# EAGLE schematic PocketCHIP-v1.0 (EAGLE 7.6.0)

## Sheet 1 of 2
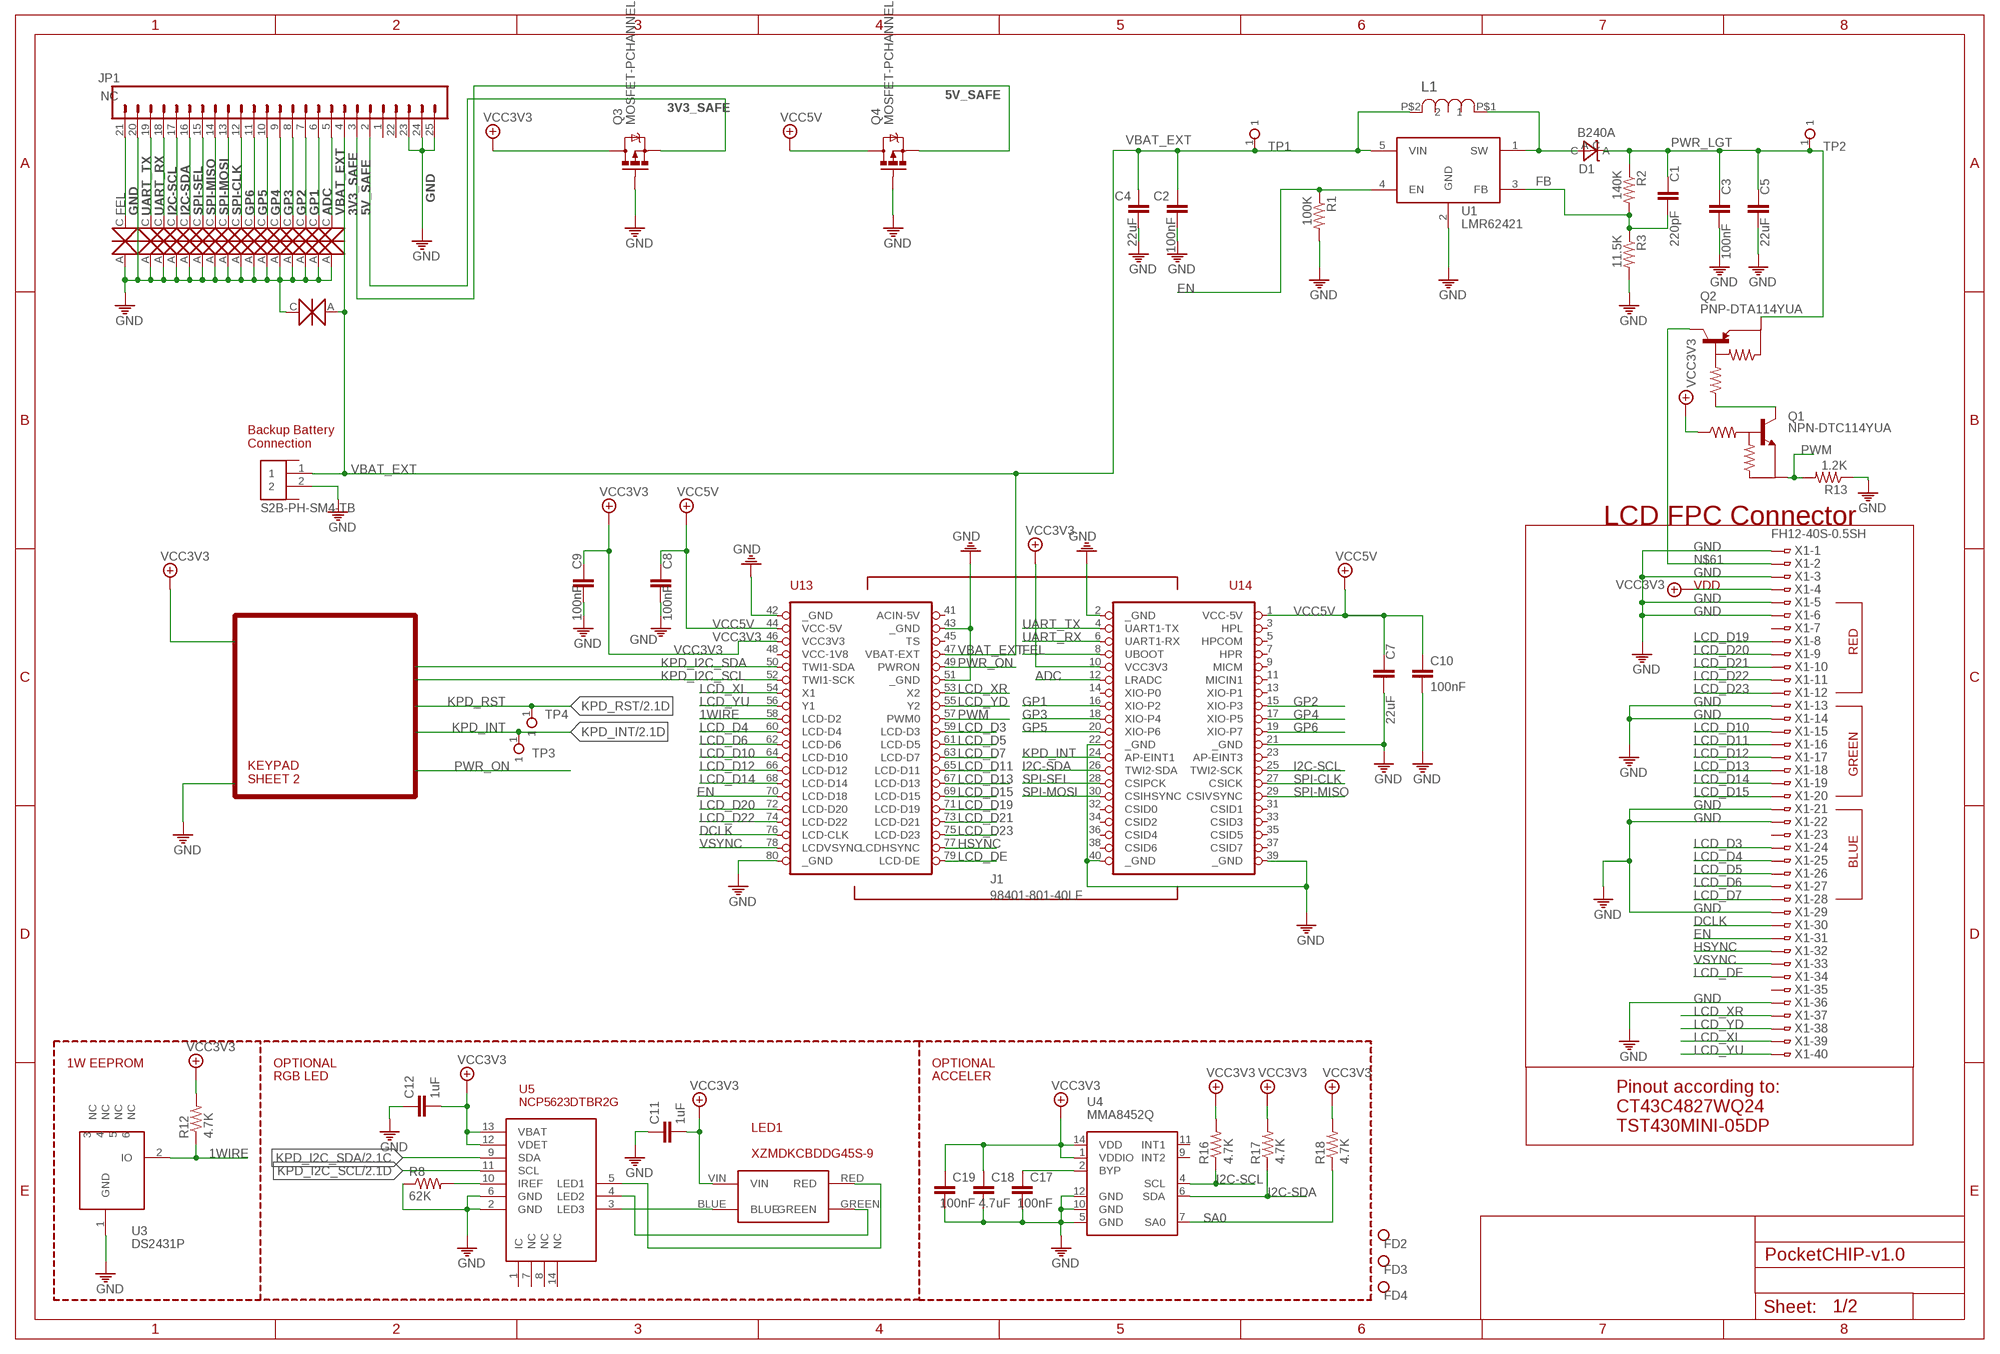
[diagram p0: schematic, sheet 1]

### Parts
C1  220pF  C0402_220PF_50V_5%  [C0402]
C2  100nF  C0402_100NF_50V_10%  [C0402]
C3  100nF  C0402_100NF_50V_10%  [C0402]
C4  22uF  C1206_22UF_50V_10%  [C1206]
C5  22uF  C1206_22UF_50V_10%  [C1206]
C7  22uF  C1206_22UF_50V_10%  [C1206]
C8  100nF  C0402_100NF_50V_10%  [C0402]
C9  100nF  C0402_100NF_50V_10%  [C0402]
C10  100nF  C0402_100NF_50V_10%  [C0402]
C11  1uF  C0402_1UF_50V_10%  [C0402]
C12  1uF  C0402_1UF_50V_10%  [C0402]
C17  100nF  C0402_100NF_50V_10%  [C0402]
C18  4.7uF  C0402_100NF_50V_10%  [C0402]
C19  100nF  C0402_100NF_50V_10%  [C0402]
D1  B240A  DIODE_SCHTKY_B240  [DO-214AC]
ESD1  ESD5Z2.5T1G  [SOD523]
ESD2  ESD5Z2.5T1G  [SOD523]
ESD3  ESD5Z2.5T1G  [SOD523]
ESD4  ESD5Z2.5T1G  [SOD523]
ESD5  ESD5Z2.5T1G  [SOD523]
ESD6  ESD5Z2.5T1G  [SOD523]
ESD7  ESD5Z2.5T1G  [SOD523]
ESD8  ESD5Z2.5T1G  [SOD523]
ESD9  ESD5Z2.5T1G  [SOD523]
ESD10  ESD5Z2.5T1G  [SOD523]
ESD11  ESD5Z2.5T1G  [SOD523]
ESD12  ESD5Z2.5T1G  [SOD523]
ESD13  ESD5Z2.5T1G  [SOD523]
ESD14  ESD5Z2.5T1G  [SOD523]
ESD15  ESD5Z2.5T1G  [SOD523]
ESD16  ESD5Z2.5T1G  [SOD523]
ESD17  ESD5Z2.5T1G  [SOD523]
FD2  FIDUCIAL  [FIDUCIAL_1MM]
FD3  FIDUCIAL  [FIDUCIAL_1MM]
FD4  FIDUCIAL  [FIDUCIAL_1MM]
J1  98401-801-40LF  [98401-801-40LF]
J3  S2B-PH-SM4-TB  [S2B-PH-SM4-TB]
JP1  NC  M20LOCK_LONGPADS  [1X20_LOCK_LONGPADS]
L1  SRN6045-100M  [SRN6045]
LED1  XZMDKCBDDG45S-9  [XZMDKCBDDG45S-9]
Q1  NPN-DTC114YUA  [SOT323]
Q2  PNP-DTA114YUA  [SOT323]
Q3  MOSFET-PCHANNEL  [SOT23-3]
Q4  MOSFET-PCHANNEL  [SOT23-3]
R1  100K  R0402_100K_5%  [R0402]
R2  140K  R0402_140K_1%  [R0402]
R3  11.5K  R0402_11K5_1%  [R0402]
R8  62K  R0402_62K_5%  [R0402]
R12  4.7K  R0402_4K7_5%  [R0402]
R13  1.2K  R0402_1K_5%  [R0402]
R16  4.7K  R0402_4K7_5%  [R0402]
R17  4.7K  R0402_4K7_5%  [R0402]
R18  4.7K  R0402_4K7_5%  [R0402]
TP1  N.C  TP_SMD_0_5MM  [TP_19_5]
TP2  N.C  TP_SMD_0_5MM  [TP_19_5]
TP3  N.C  TP_SMD_0_5MM  [TP_19_5]
TP4  N.C  TP_SMD_0_5MM  [TP_19_5]
U1  LMR62421  [SOT23-5]
U3  DS2431P  [TSOC6]
U4  MMA8452Q  [QFN-16_0.5MM]
U5  NCP5623DTBR2G  [TSSOP14]
X1  FH12-40S-0.5SH  [FH12-40S-0.5SH]

### Nets
1WIRE: J1.58(LCD-D2) R12.1 U3.2(IO)
3V3_SAFE: JP1.2 Q3.2(S)
5V_SAFE: JP1.3 Q4.2(S)
ADC: ESD16.C J1.12(LRADC) JP1.5
DCLK: J1.76(LCD-CLK) X1.30
EN: J1.70(LCD-D18) R1.1 U1.4(EN) X1.31
FB: C1.2 R2.2 R3.1 U1.3(FB)
FEL: ESD1.C J1.8(UBOOT) JP1.21
GND: C2.2 C3.2 C4.2 C5.2 C7.2 C8.2 C9.2 C10.2 C11.1 C12.1 C17.2 C18.2 C19.2 ESD1.A ESD2.A ESD3.A ESD4.A ESD5.A ESD6.A ESD7.A ESD8.A ESD9.A ESD10.A ESD11.A ESD12.A ESD13.A ESD14.A ESD15.A ESD16.A ESD17.C J1.2(_GND) J1.21(_GND) J1.22(_GND) J1.39(_GND) J1.40(_GND) J1.42(_GND) J1.43(_GND) J1.51(_GND) J1.80(_GND) J3.2 JP1.20 JP1.23 JP1.24 JP1.25 Q3.1(G) Q4.1(G) R1.2 R3.2 R8.1 R13.1 U1.2(GND) U3.1(GND) U4.5(GND) U4.10(GND) U4.12(GND) U5.2(GND) U5.6(GND) X1.1 X1.3 X1.5 X1.6 X1.13 X1.14 X1.21 X1.22 X1.29 X1.36 ; also sheet 2
GP1: ESD15.C J1.16(XIO-P2) JP1.6
GP2: ESD14.C J1.15(XIO-P3) JP1.7
GP3: ESD13.C J1.18(XIO-P4) JP1.8
GP4: ESD12.C J1.17(XIO-P5) JP1.9
GP5: ESD11.C J1.20(XIO-P6) JP1.10
GP6: ESD10.C J1.19(XIO-P7) JP1.11
HSYNC: J1.77(LCDHSYNC) X1.32
I2C-SCL: ESD4.C J1.25(TWI2-SCK) JP1.17 R16.1 U4.4(SCL)
I2C-SDA: ESD5.C J1.26(TWI2-SDA) JP1.16 R17.1 U4.6(SDA)
KPD_I2C_SCL: J1.52(TWI1-SCK) U5.11(SCL) ; also sheet 2
KPD_I2C_SDA: J1.50(TWI1-SDA) U5.9(SDA) ; also sheet 2
KPD_INT: J1.24(AP-EINT1) TP3.1 ; also sheet 2
KPD_RST: TP4.1 ; also sheet 2
LCD_D3: J1.59(LCD-D3) X1.24
LCD_D4: J1.60(LCD-D4) X1.25
LCD_D5: J1.61(LCD-D5) X1.26
LCD_D6: J1.62(LCD-D6) X1.27
LCD_D7: J1.63(LCD-D7) X1.28
LCD_D10: J1.64(LCD-D10) X1.15
LCD_D11: J1.65(LCD-D11) X1.16
LCD_D12: J1.66(LCD-D12) X1.17
LCD_D13: J1.67(LCD-D13) X1.18
LCD_D14: J1.68(LCD-D14) X1.19
LCD_D15: J1.69(LCD-D15) X1.20
LCD_D19: J1.71(LCD-D19) X1.8
LCD_D20: J1.72(LCD-D20) X1.9
LCD_D21: J1.73(LCD-D21) X1.10
LCD_D22: J1.74(LCD-D22) X1.11
LCD_D23: J1.75(LCD-D23) X1.12
LCD_DE: J1.79(LCD-DE) X1.34
LCD_XL: J1.54(X1) X1.39
LCD_XR: J1.53(X2) X1.37
LCD_YD: J1.55(Y2) X1.38
LCD_YU: J1.56(Y1) X1.40
N$48: C17.1 U4.2(BYP)
N$50: LED1.GREEN U5.4(LED2)
N$51: LED1.RED U5.5(LED1)
N$53: R8.2 U5.10(IREF)
N$61: Q2.3(OUT) X1.2
N$63: Q1.3(OUT) Q2.1(IN)
N$555: LED1.BLUE U5.3(LED3)
PWM: J1.57(PWM0) Q1.2(GND) R13.2
PWR_LGT: C1.1 C3.1 C5.1 D1.C Q2.2(GND) R2.1 TP2.1
PWR_ON: J1.49(PWRON) ; also sheet 2
SA0: R18.1 U4.7(SA0)
SPI-CLK: ESD9.C J1.27(CSICK) JP1.12
SPI-MISO: ESD7.C J1.29(CSIVSYNC) JP1.14
SPI-MOSI: ESD8.C J1.30(CSIHSYNC) JP1.13
SPI-SEL: ESD6.C J1.28(CSIPCK) JP1.15
UART_RX: ESD3.C J1.6(UART1-RX) JP1.18
UART_TX: ESD2.C J1.4(UART1-TX) JP1.19
VBAT_EXT: C2.1 C4.1 ESD17.A J1.47(VBAT-EXT) J3.1 JP1.4 L1.P$2 TP1.1 U1.5(VIN)
VCC3V3: C9.1 C11.2 C12.2 C18.1 C19.1 J1.10(VCC3V3) J1.46(VCC3V3) LED1.VIN Q1.1(IN) Q3.3(D) R12.2 R16.2 R17.2 R18.2 U4.1(VDDIO) U4.14(VDD) U5.12(VDET) U5.13(VBAT) X1.4 ; also sheet 2
VCC5V: C7.1 C8.1 C10.1 J1.1(VCC-5V) J1.44(VCC-5V) Q4.3(D)
VREG_OUTPUT: D1.A L1.P$1 U1.1(SW)
VSYNC: J1.78(LCDVSYNC) X1.33
Unconnected: J1.3(HPL) J1.5(HPCOM) J1.7(HPR) J1.9(MICM) J1.11(MICIN1) J1.13(XIO-P1) J1.14(XIO-P0) J1.23(AP-EINT3) J1.31(CSID1) J1.32(CSID0) J1.33(CSID3) J1.34(CSID2) J1.35(CSID5) J1.36(CSID4) J1.37(CSID7) J1.38(CSID6) J1.41(ACIN-5V) J1.45(TS) J1.48(VCC-1V8) J3.MNT1 J3.MNT2 JP1.1 JP1.22 U3.3(NC) U3.4(NC) U3.5(NC) U3.6(NC) U4.9(INT2) U4.11(INT1) U5.1(IC) U5.7(NC) U5.8(NC) U5.14(NC) X1.7 X1.23 X1.35

### Notes on the sheet
- Backup Battery
  Connection
- LCD FPC Connector
- VDD
- RED
- GREEN
- KEYPAD
  SHEET 2
- BLUE
- 1W EEPROM | OPTIONAL | OPTIONAL
- RGB LED | ACCELER
- Pinout according to:
  CT43C4827WQ24
  TST430MINI-05DP

## Sheet 2 of 2
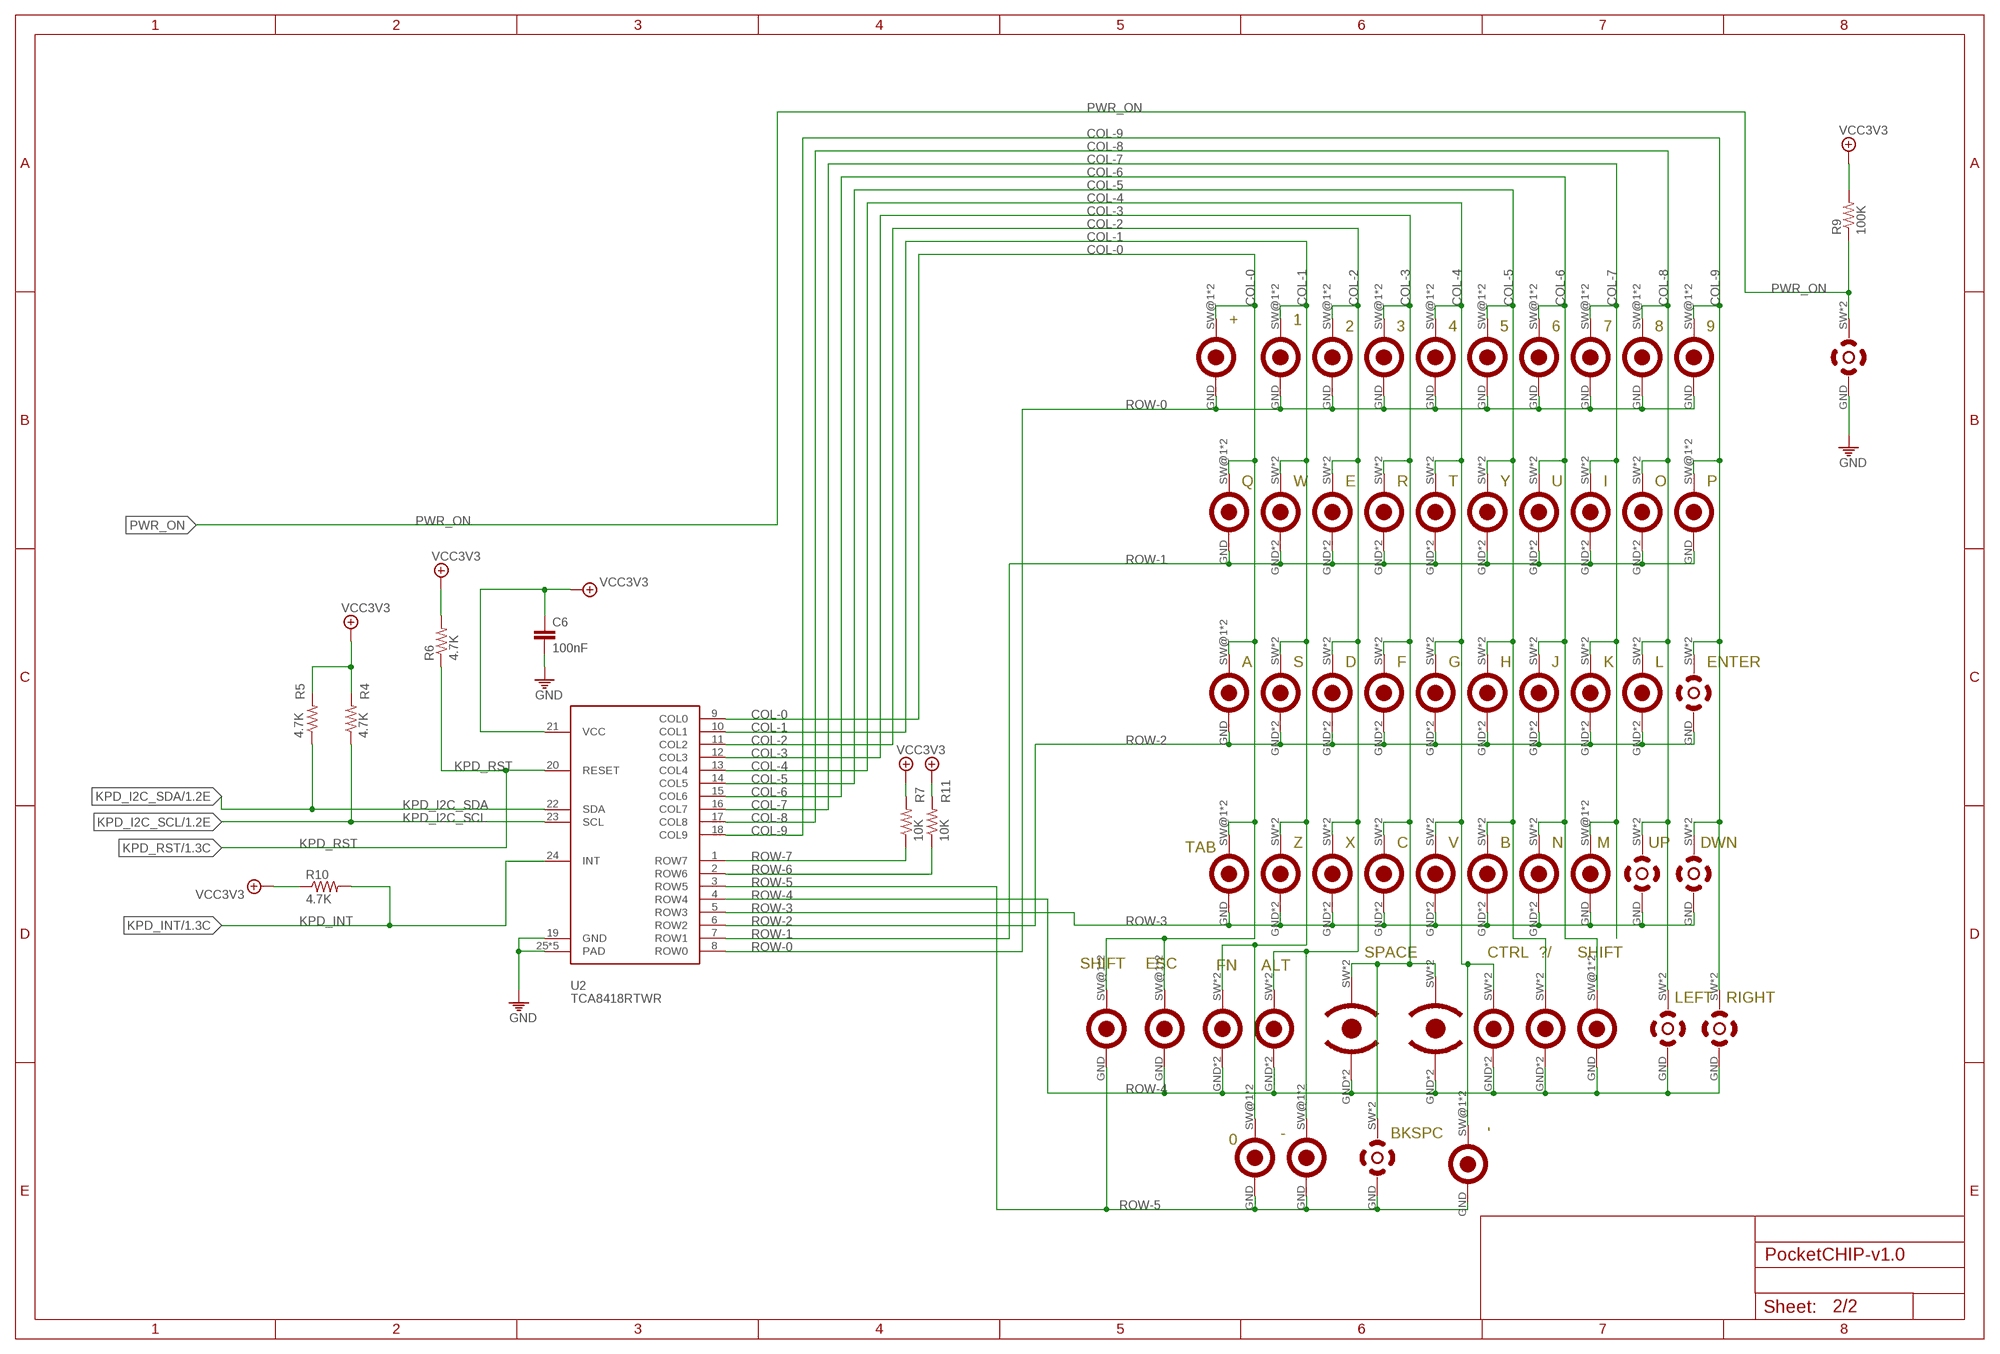
[diagram p1: schematic, sheet 2]

### Parts
0  M272201PAD  [SNAPDOME_M27220_1PAD]
1  M272201PAD  [SNAPDOME_M27220_1PAD]
2  M272201PAD  [SNAPDOME_M27220_1PAD]
3  M272201PAD  [SNAPDOME_M27220_1PAD]
4  M272201PAD  [SNAPDOME_M27220_1PAD]
5  M272201PAD  [SNAPDOME_M27220_1PAD]
6  M272201PAD  [SNAPDOME_M27220_1PAD]
7  M272201PAD  [SNAPDOME_M27220_1PAD]
8  M272201PAD  [SNAPDOME_M27220_1PAD]
9  M272201PAD  [SNAPDOME_M27220_1PAD]
'  M272201PAD  [SNAPDOME_M27220_1PAD]
+  M272201PAD  [SNAPDOME_M27220_1PAD]
-  M272201PAD  [SNAPDOME_M27220_1PAD]
?/  M27220  [SNAPDOME_M27220]
A  M272201PAD  [SNAPDOME_M27220_1PAD]
ALT  M27220  [SNAPDOME_M27220]
B  M27220  [SNAPDOME_M27220]
BKSPC  BL08260  [SNAPDOME_BL08260]
C  M27220  [SNAPDOME_M27220]
C6  100nF  C0402_100NF_50V_10%  [C0402]
CTRL  M272201PAD  [SNAPDOME_M27220_1PAD]
D  M27220  [SNAPDOME_M27220]
DWN  E9-TDF-340  [SNAPDOME_E9-TDF-340]
E  M27220  [SNAPDOME_M27220]
ENTER  BL08260  [SNAPDOME_BL08260]
ESC  M272201PAD  [SNAPDOME_M27220_1PAD]
F  M27220  [SNAPDOME_M27220]
FN  M27220  [SNAPDOME_M27220]
G  M27220  [SNAPDOME_M27220]
H  M27220  [SNAPDOME_M27220]
I  M27220  [SNAPDOME_M27220]
J  M27220  [SNAPDOME_M27220]
K  M27220  [SNAPDOME_M27220]
L  M27220  [SNAPDOME_M27220]
LEFT  E9-TDF-340  [SNAPDOME_E9-TDF-340]
M  M272201PAD  [SNAPDOME_M27220_1PAD]
N  M27220  [SNAPDOME_M27220]
O  M27220  [SNAPDOME_M27220]
P  M272201PAD  [SNAPDOME_M27220_1PAD]
PWR  100105  [SNAPDOME_100105]
Q  M272201PAD  [SNAPDOME_M27220_1PAD]
R  M27220  [SNAPDOME_M27220]
R4  4.7K  R0402_4K7_5%  [R0402]
R5  4.7K  R0402_4K7_5%  [R0402]
R6  4.7K  R0402_1K_5%  [R0402]
R7  10K  R0402_4K7_5%  [R0402]
R9  100K  R0402_100K_5%  [R0402]
R10  4.7K  R0402_1K_5%  [R0402]
R11  10K  R0402_4K7_5%  [R0402]
RIGHT  E9-TDF-340  [SNAPDOME_E9-TDF-340]
S  M27220  [SNAPDOME_M27220]
SHFT  M272201PAD  [SNAPDOME_M27220_1PAD]
SHIFT  M272201PAD  [SNAPDOME_M27220_1PAD]
SPACEL  E.22-ONN-230  [SNAPDOME_E.22-ONN-230]
SPACER  E.22-ONN-230  [SNAPDOME_E.22-ONN-230]
T  M27220  [SNAPDOME_M27220]
TAB  M27220  [SNAPDOME_M27220]
U  M27220  [SNAPDOME_M27220]
U2  TCA8418RTWR  [WQFN24]
UP  E9-TDF-340  [SNAPDOME_E9-TDF-340]
V  M27220  [SNAPDOME_M27220]
W  M27220  [SNAPDOME_M27220]
X  M27220  [SNAPDOME_M27220]
Y  M27220  [SNAPDOME_M27220]
Z  M27220  [SNAPDOME_M27220]

### Nets
COL-0: 1.SW@1(SW) 1.SW@2(SW) A.SW@1(SW) A.SW@2(SW) CTRL.SW@1(SW) CTRL.SW@2(SW) ESC.SW@1(SW) ESC.SW@2(SW) Q.SW@1(SW) Q.SW@2(SW) SHIFT.SW@1(SW) SHIFT.SW@2(SW) U2.9(COL0)
COL-1: 2.SW@1(SW) 2.SW@2(SW) -.SW@1(SW) -.SW@2(SW) FN.SW FN.SW1(SW) S.SW S.SW1(SW) U2.10(COL1) W.SW W.SW1(SW) Z.SW Z.SW1(SW)
COL-2: 3.SW@1(SW) 3.SW@2(SW) +.SW@1(SW) +.SW@2(SW) ALT.SW ALT.SW1(SW) D.SW D.SW1(SW) E.SW E.SW1(SW) U2.11(COL2) X.SW X.SW1(SW)
COL-3: 4.SW@1(SW) 4.SW@2(SW) BKSPC.SW BKSPC.SW1(SW) C.SW C.SW1(SW) F.SW F.SW1(SW) R.SW R.SW1(SW) SPACEL.SW SPACEL.SW1(SW) SPACER.SW SPACER.SW1(SW) U2.12(COL3)
COL-4: 5.SW@1(SW) 5.SW@2(SW) '.SW@1(SW) '.SW@2(SW) G.SW G.SW1(SW) T.SW T.SW1(SW) TAB.SW TAB.SW1(SW) U2.13(COL4) V.SW V.SW1(SW)
COL-5: 6.SW@1(SW) 6.SW@2(SW) ?/.SW ?/.SW1(SW) B.SW B.SW1(SW) H.SW H.SW1(SW) U2.14(COL5) Y.SW Y.SW1(SW)
COL-6: 7.SW@1(SW) 7.SW@2(SW) J.SW J.SW1(SW) N.SW N.SW1(SW) SHFT.SW@1(SW) SHFT.SW@2(SW) U2.15(COL6) U.SW U.SW1(SW)
COL-7: 8.SW@1(SW) 8.SW@2(SW) I.SW I.SW1(SW) K.SW K.SW1(SW) M.SW@1(SW) M.SW@2(SW) U2.16(COL7)
COL-8: 9.SW@1(SW) 9.SW@2(SW) L.SW L.SW1(SW) LEFT.SW LEFT.SW1(SW) O.SW O.SW1(SW) U2.17(COL8) UP.SW UP.SW1(SW)
COL-9: 0.SW@1(SW) 0.SW@2(SW) DWN.SW DWN.SW1(SW) ENTER.SW ENTER.SW1(SW) P.SW@1(SW) P.SW@2(SW) RIGHT.SW RIGHT.SW1(SW) U2.18(COL9)
GND: C6.2 PWR.GND U2.19(GND) U2.25(PAD) U2.H1(PAD) U2.H2(PAD) U2.H3(PAD) U2.H4(PAD) ; also sheet 1
KPD_I2C_SCL: R4.1 U2.23(SCL) ; also sheet 1
KPD_I2C_SDA: R5.1 U2.22(SDA) ; also sheet 1
KPD_INT: R10.2 U2.24(INT) ; also sheet 1
KPD_RST: R6.1 U2.20(RESET) ; also sheet 1
PWR_ON: PWR.SW PWR.SW1(SW) R9.1 ; also sheet 1
ROW-0: 0.GND 1.GND 2.GND 3.GND 4.GND 5.GND 6.GND 7.GND 8.GND 9.GND U2.8(ROW0)
ROW-1: E.GND E.GND@1(GND) I.GND I.GND@1(GND) O.GND O.GND@1(GND) P.GND Q.GND R.GND R.GND@1(GND) T.GND T.GND@1(GND) U2.7(ROW1) U.GND U.GND@1(GND) W.GND W.GND@1(GND) Y.GND Y.GND@1(GND)
ROW-2: A.GND D.GND D.GND@1(GND) ENTER.GND F.GND F.GND@1(GND) G.GND G.GND@1(GND) H.GND H.GND@1(GND) J.GND J.GND@1(GND) K.GND K.GND@1(GND) L.GND L.GND@1(GND) S.GND S.GND@1(GND) U2.6(ROW2)
ROW-3: B.GND B.GND@1(GND) C.GND C.GND@1(GND) DWN.GND M.GND N.GND N.GND@1(GND) SHIFT.GND U2.5(ROW3) UP.GND V.GND V.GND@1(GND) X.GND X.GND@1(GND) Z.GND Z.GND@1(GND)
ROW-4: ?/.GND ?/.GND@1(GND) ALT.GND ALT.GND@1(GND) ESC.GND FN.GND FN.GND@1(GND) LEFT.GND RIGHT.GND SHFT.GND SPACEL.GND SPACEL.GND@1(GND) SPACER.GND SPACER.GND@1(GND) TAB.GND TAB.GND@1(GND) U2.4(ROW4)
ROW-5: '.GND +.GND -.GND BKSPC.GND CTRL.GND U2.3(ROW5)
ROW-6: R11.1 U2.2(ROW6)
ROW-7: R7.1 U2.1(ROW7)
VCC3V3: C6.1 R4.2 R5.2 R6.2 R7.2 R9.2 R10.1 R11.2 U2.21(VCC) ; also sheet 1

### Notes on the sheet
- + | 1
- 2 | 3 | 4 | 5 | 6 | 7 | 8 | 9
- Q | W | E | R | T | Y | U | I | O | P
- A | S | D | F | G | H | J | K | L | ENTER
- TAB
- Z | X | C | V | B | N | M | UP | DWN
- SHIFT | ESC | SPACE | CTRL | ?/ | SHIFT
- FN | ALT
- LEFT | RIGHT
- - | BKSPC | '
- 0

## Library data of the parts
0 1-9 ' + - ?/ A ALT B C CTRL D E ESC F FN G H I J K L M N O P Q R S SHFT SHIFT T TAB U V W X Y Z = PocketCHIP-Components-v0.71:M27220
BKSPC ENTER = PocketCHIP-Components-v0.7:BL08260
C1 = Keyboard v0_5:C0402_220PF_50V_5%; DESCRIPTION: CAP SMD 220pF 50V 5% 0402; FOOTPRINT: C0402; LINK: http://www.digikey.com/product-detail/en/C0402C221J5GACTU/399-7776-1-ND/3471499; MFG: DIGIIKEY; MFG_PN: 399-7776-1-ND; PART_TYPE: C0402; PRICE: 0.01; TOLLERANCE: 5%; VENDOR: KEMET; VENDOR_PART_NUMBER: C0402C221J5GACTU
C2 C3 C6 C8-C10 = Keyboard v0_5:C0402_100NF_50V_10%; DESCRIPTION: CAP CER SMD 100nF 25V 10% 0402; FOOTPRINT: C0402; LINK: http://www.digikey.co.il/product-detail/en/C1005X5R1E104K050BC/445-4964-1-ND/2093578; MFG: DIGIIKEY; MFG_PN: 445-4964-1-ND; PART_TYPE: C0402; PRICE: 0.01; TOLLERANCE: 10%; VENDOR: TDK; VENDOR_PART_NUMBER: C1005X5R1E104K050BC
C4 C5 C7 = Keyboard v0_5:C1206_22UF_50V_10%; DESCRIPTION: CAP ceramic smd 20% 35V 1206; FOOTPRINT: C1206; LINK: http://www.digikey.com/product-detail/en/C3216X5R1V226M160AC/445-8045-1-ND/2792165; MFG: DIGIKEY; MFG_PN: 445-8045-1-ND; PART_TYPE: C1206; PRICE: 0.01; TOLLERANCE: 20%; VENDOR: TDK; VENDOR_PART_NUMBER: C3216X5R1V226M160AC
C11 C12 = Keyboard_v0_7:C0402_1UF_50V_10%; DESCRIPTION: CAP CER SMD 100nF 25V 10% 0402; FOOTPRINT: C0402; LINK: http://www.digikey.co.il/product-detail/en/C1005X5R1E104K050BC/445-4964-1-ND/2093578; MFG: DIGIIKEY; MFG_PN: 445-4964-1-ND; PART_TYPE: C0402; PRICE: 0.01; TOLLERANCE: 10%; VALUE: 100nF; VENDOR: TDK; VENDOR_PART_NUMBER: C1005X5R1E104K050BC
C17 C19 = PocketCHIP-Components-v0.71:C0402_100NF_50V_10%; DESCRIPTION: CAP CER SMD 100nF 25V 10% 0402; FOOTPRINT: C0402; LINK: http://www.digikey.co.il/product-detail/en/C1005X5R1E104K050BC/445-4964-1-ND/2093578; MFG: DIGIIKEY; MFG_PN: 445-4964-1-ND; PART_TYPE: C0402; PRICE: 0.01; TOLLERANCE: 10%; VENDOR: TDK; VENDOR_PART_NUMBER: C1005X5R1E104K050BC
C18 = PocketCHIP-Components-v0.71:C0402_100NF_50V_10%; DESCRIPTION: CAP CER SMD 100nF 25V 10% 0402; FOOTPRINT: C0402; LINK: http://www.digikey.co.il/product-detail/en/C1005X5R1E104K050BC/445-4964-1-ND/2093578; MFG: DIGIIKEY; MFG_PN: 445-4964-1-ND; PART_TYPE: C0402; PRICE: 0.01; TOLLERANCE: 10%; VALUE: 100nF; VENDOR: TDK; VENDOR_PART_NUMBER: C1005X5R1E104K050BC
D1 = Keyboard v0_5:DIODE_SCHTKY_B240; DESCRIPTION: DIODE SMD General Purpose 400V 1A 1.4W RoHS DO-214AC; FOOTPRINT: DO-214AC; LINK: http://www.digikey.com/product-detail/en/B240A-13-F/B240A-FDICT-ND/717810; MFG: DIGIKEY; MFG_PN: B240A-FDICT-ND; PART_TYPE: DIODE; PRICE: 0.11; VENDOR: DIODES; VENDOR_PART_NUMBER: B240A-13-F
DWN LEFT RIGHT UP = PocketCHIP-Components-v0.71:E9-TDF-340
ESD1-ESD17 = PocketCHIP-Components-v0.71:ESD5Z2.5T1G
FD2-FD4 = Keyboard v0.3:FIDUCIAL; ASSEMBLE: N.C; DESCRIPTION: Fiducial; PART_NUMBER: RB00000042
J1 = PocketCHIP-v1.0:98401-801-40LF
J3 = Keyboard v0_5:S2B-PH-SM4-TB; DESCRIPTION: 2 pin con, 2MM RA, SMD; FOOTPRINT: S2B-PH-SM4-TB; LINK: http://www.digikey.com/product-detail/en/S2B-PH-SM4-TB(LF)(SN)/455-1749-1-ND/926846; MFG: DIGIKEY; MFG_PN: 455-1749-1-ND; PART_TYPE: CON; PRICE: 0.26; VENDOR: JST; VENDOR_PART_NUMBER: S2B-PH-SM4-TB(LF)(SN)
JP1 = PocketCHIP-Components-v0.71:M20: 1x20 .1" header This is just like the LOCK variant in that the holes are staggared by 5 mil, but except for the last two holes. They are not altered from the "standard" footprint layout. This is used for a special purpose on the layout of our Graphic LCD Backpack. Make sure you want to use this device before selecting it for you project!
L1 = Keyboard v0_5:SRN6045-100M; DESCRIPTION: power inductor 10uH 2.5A 58.6 mohm; FOOTPRINT: SRN6045; LINK: http://www.digikey.com/product-detail/en/SRN6045-100M/SRN6045-100MTR-ND/2756120; MFG: DIGIKEY; MFG_PN: SRN6045-100MTR-ND; PART_TYPE: IND; PRICE: 0.15; TOLLERANCE: ±20%; VENDOR: BOURNS; VENDOR_PART_NUMBER: SRN6045-100M
LED1 = PocketCHIP-Components-v0.71:XZMDKCBDDG45S-9
PWR = PocketCHIP-Components-v0.7:100105
Q1 = PocketCHIP-Components-v0.72:NPN-DTC114YUA
Q2 = PocketCHIP-Components-v0.72:PNP-DTA114YUA
Q3 Q4 = PocketCHIP-Components-v0.72:MOSFET-PCHANNEL: Generic PMOSFET; PROD_ID: TRANS-08285
R1 R9 = Keyboard v0_5:R0402_100K_5%; DESCRIPTION: RES THICK FILM SMD 100K Ohm 1/16W 5% RoHS 0402; FOOTPRINT: R0402; LINK: http://www.digikey.co.il/product-detail/en/ERJ-2GEJ104X/P100KJCT-ND/146730; MFG: DIGIKEY; MFG_PN: P100KJCT-ND; PART_TYPE: R0402; PRICE: 0.01; TOLLERANCE: 5%; VENDOR: PANASONIC; VENDOR_PART_NUMBER: ERJ-2GEJ104X
R2 = Keyboard v0_5:R0402_140K_1%; DESCRIPTION: RES SMD 140K 1/16W 1% 0402; FOOTPRINT: R0402; LINK: http://www.digikey.com/product-detail/en/RC0402FR-07140KL/YAG2978CT-ND/5281843; MFG: DIGIKEY; MFG_PN: YAG2978CT-ND; PART_TYPE: R0402; PRICE: 0.01; TOLLERANCE: 1%; VENDOR: YAGEO; VENDOR_PART_NUMBER: RC0402FR-07140KL
R3 = Keyboard v0_5:R0402_11K5_1%; DESCRIPTION: RES SMD 11.5K 1/16W 1% 0402; FOOTPRINT: R0402; LINK: http://www.digikey.com/product-detail/en/RC0402FR-0711K5L/311-11.5KLRCT-ND/729477; MFG: DIGIKEY; MFG_PN: 311-11.5KLRCT-ND; PART_TYPE: R0402; PRICE: 0.01; TOLLERANCE: 1%; VENDOR: YAGEO; VENDOR_PART_NUMBER: RC0402FR-0711K5L
R4 R5 R12 = Keyboard v0_5:R0402_4K7_5%; DESCRIPTION: RES SMD 4.7K Ohm 1/16W 5% oHS 0402; FOOTPRINT: R0402; LINK: http://search.digikey.com/us/en/products/ERJ-2GEJ472X/P4.7KJCT-ND/147025; MFG: DIGIKEY; MFG_PN: P4.7KJCT-ND; PART_TYPE: R0402; PRICE: 0.01; TOLLERANCE: 5%; VENDOR: PANASONIC; VENDOR_PART_NUMBER: ERJ-2GEJ472X
R6 R10 = Keyboard v0_5:R0402_1K_5%; DESCRIPTION: RES SMD 1K Ohm 1/16W 5% 0402; FOOTPRINT: R0402; LINK: http://search.digikey.com/us/en/products/ERJ-2GEJ102X/P1.0KJCT-ND/146897; MFG: DIGIKEY; MFG_PN: P1.0KJCT-ND; PART_TYPE: R0402; PRICE: 0.01; TOLLERANCE: 5%; VALUE: 1K; VENDOR: PANASONIC; VENDOR_PART_NUMBER: ERJ-2GEJ102X
R7 R11 = Keyboard v0_5:R0402_4K7_5%; DESCRIPTION: RES SMD 4.7K Ohm 1/16W 5% oHS 0402; FOOTPRINT: R0402; LINK: http://search.digikey.com/us/en/products/ERJ-2GEJ472X/P4.7KJCT-ND/147025; MFG: DIGIKEY; MFG_PN: P4.7KJCT-ND; PART_TYPE: R0402; PRICE: 0.01; TOLLERANCE: 5%; VALUE: 4.7K; VENDOR: PANASONIC; VENDOR_PART_NUMBER: ERJ-2GEJ472X
R8 = Keyboard_v0_7:R0402_62K_5%; DESCRIPTION: RES SMD 1K Ohm 1/16W 5% 0402; FOOTPRINT: R0402; LINK: http://search.digikey.com/us/en/products/ERJ-2GEJ102X/P1.0KJCT-ND/146897; MFG: DIGIKEY; MFG_PN: P1.0KJCT-ND; PART_TYPE: R0402; PRICE: 0.01; TOLLERANCE: 5%; VALUE: 1K; VENDOR: PANASONIC; VENDOR_PART_NUMBER: ERJ-2GEJ102X
R13 = PocketCHIP-Components-v0.72:R0402_1K_5%; DESCRIPTION: RES SMD 1K Ohm 1/16W 5% 0402; FOOTPRINT: R0402; LINK: http://search.digikey.com/us/en/products/ERJ-2GEJ102X/P1.0KJCT-ND/146897; MFG: DIGIKEY; MFG_PN: P1.0KJCT-ND; PART_TYPE: R0402; PRICE: 0.01; TOLLERANCE: 5%; VALUE: 1K; VENDOR: PANASONIC; VENDOR_PART_NUMBER: ERJ-2GEJ102X
R16-R18 = PocketCHIP-Components-v0.71:R0402_4K7_5%; DESCRIPTION: RES SMD 4.7K Ohm 1/16W 5% oHS 0402; FOOTPRINT: R0402; LINK: http://search.digikey.com/us/en/products/ERJ-2GEJ472X/P4.7KJCT-ND/147025; MFG: DIGIKEY; MFG_PN: P4.7KJCT-ND; PART_TYPE: R0402; PRICE: 0.01; TOLLERANCE: 5%; VENDOR: PANASONIC; VENDOR_PART_NUMBER: ERJ-2GEJ472X
SPACEL SPACER = PocketCHIP-Components-v0.71:E.22-ONN-230
TP1 TP2 = PocketCHIP-Components-v0.71:TP_SMD_0_5MM; ASSEMBLE: N.C; DESCRIPTION: test point smd 0.5mm; FOOTPRINT: TP_19_5; PART_NUMBER: RB00000140; PART_TYPE: TEST POINT; PRICE: 0
TP3 TP4 = Keyboard v0.3:TP_SMD_0_5MM; ASSEMBLE: N.C; DESCRIPTION: test point smd 0.5mm; FOOTPRINT: TP_19_5; PART_NUMBER: RB00000140; PART_TYPE: TEST POINT; PRICE: 0
U1 = PocketCHIP-Components-v0.7:LMR62421; DESCRIPTION: dc/dc step up, 2.1A, 1.6mhz, SOT-23-5; FOOTPRINT: SOT23-5; LINK: http://www.digikey.com/product-detail/en/LMR62421XMFE%2FNOPB/LMR62421XMFE%2FNOPBCT-ND/2777085; MFG: DIGIKEY; MFG_PN: LMR62421XMFE/NOPBCT-ND; PART_TYPE: IC; PRICE: 0.8; VENDOR: TEXAS INSTRUMENTS; VENDOR_PART_NUMBER: LMR62421XMFE/NOPB
U2 = Keyboard v0.3:TCA8418RTWR; DESCRIPTION: Keypad/IO I2C expander, 8 rows 10 columns; FOOTPRINT: WQFN24; LINK: http://www.digikey.com/product-detail/en/TCA8418RTWR/296-25223-1-ND/2172845; MFG: DIGIKEY; MFG_PN: 296-25223-1-ND; PART_TYPE: IC; PRICE: 1.4; VENDOR: TI; VENDOR_PART_NUMBER: TCA8418RTWR
U3 = Keyboard v0_5:DS2431: 1024-Bit EEPROM This chip provides a 4x256 Bit EEPROM, which can be programmed@5V. Write protection and OTP emulation are available, too. Author: Jan Kandziora <jjj@gmx.de>; DESCRIPTION: IC, 1024-Bit, 1-Wire EEPROM, TSOC6; FOOTPRINT: TSOC6; LINK: http://www.digikey.com/product-detail/en/DS2431P%2BT%26R/DS2431P%2BT%26RCT-ND/3647900; MFG: DIGIKEY; MFG_PN: DS2431P+T&RCT-ND; PART_TYPE: IC; PRICE: 0.98; VENDOR: MAXIM; VENDOR_PART_NUMBER: DS2431P+T&R
U4 = PocketCHIP-Components-v0.71:MMA8452Q: MMA8452Q 3-Axis, 12/8-bit Digital Accelerometer Supply Voltage: 1.6-3.6V Range: +/- 2g, 4g, 8g Interface: I2C, 12-bit and 8-bit ODR: 1.56 Hz - 800 Hz Package: QFN-16 http://cache.freescale.com/files/sensors/doc/data_sheet/MMA8452Q.pdf
U5 = PocketCHIP-Components-v0.7:NCP5623DTBR2G
X1 = Keyboard v0_5:FH12-40S-0.5S: 0.5mm Pitch Connectors For FPC/FFC Source: Data sheet <http://www.hirose.co.jp/cataloge_hp/e58605370.pdf>; DESCRIPTION: CON ffc smd, bottom contact 40pos, 0.50mm R/A; FOOTPRINT: FH12-40S-0.5SH; LINK: http://www.digikey.com/product-detail/en/FH12-40S-0.5SH(55)/HFJ140CT-ND/1110388; MFG: DIGIKEY; MFG_PN: HFJ140CT-ND; VENDOR: HIROSE; VENDOR_PART_NUMBER: FH12-40S-0.5SH(55)